# EAGLE schematic GenericCommand (EAGLE 9.1.3)
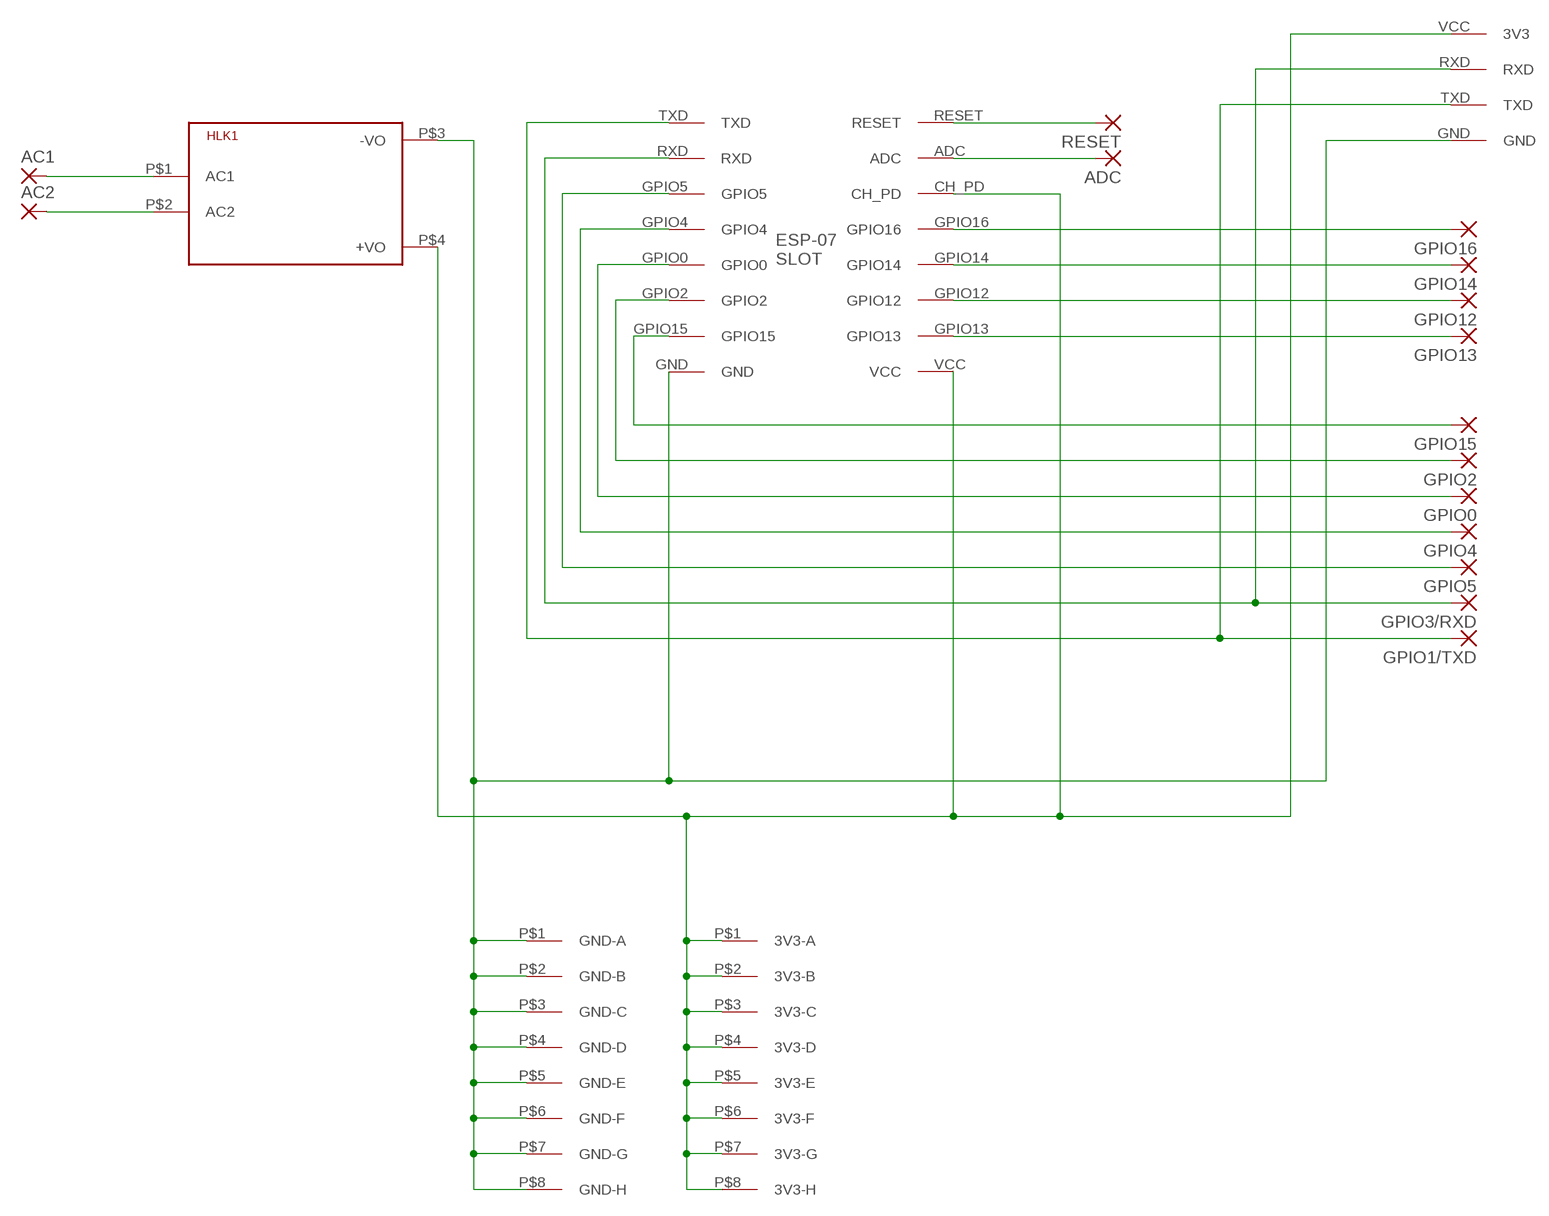
[diagram p0: schematic, sheet 1]

## Parts
AC1  3,81/1,4  [3,81/1,4]
AC2  3,81/1,4  [3,81/1,4]
ADC  1,6/0,9  [1,6/0,9]
GPIO0  1,6/0,9  [1,6/0,9]
GPIO1/TXD  1,6/0,9  [1,6/0,9]
GPIO2  1,6/0,9  [1,6/0,9]
GPIO3/RXD  1,6/0,9  [1,6/0,9]
GPIO4  1,6/0,9  [1,6/0,9]
GPIO5  1,6/0,9  [1,6/0,9]
GPIO12  1,6/0,9  [1,6/0,9]
GPIO13  1,6/0,9  [1,6/0,9]
GPIO14  1,6/0,9  [1,6/0,9]
GPIO15  1,6/0,9  [1,6/0,9]
GPIO16  1,6/0,9  [1,6/0,9]
HLK1  HLK-PM013W  [HLK-PM01]
RESET  1,6/0,9  [1,6/0,9]
U$1  ESP-07  [ESP-07]
U$2  CP-2102-CONN  [CP-2102-CONN]
U$3  3V3-8  [3.3V-8]
U$4  GND-8  [GND-8]

## Nets
N$1: GPIO15.1(P) U$1.GPIO15
N$2 [3.3VPower]: HLK1.P$3(-VO) U$1.GND U$2.GND U$4.P$1(GND-A) U$4.P$2(GND-B) U$4.P$3(GND-C) U$4.P$4(GND-D) U$4.P$5(GND-E) U$4.P$6(GND-F) U$4.P$7(GND-G) U$4.P$8(GND-H)
N$3: GPIO2.1(P) U$1.GPIO2
N$4: GPIO0.1(P) U$1.GPIO0
N$5: GPIO16.1(P) U$1.GPIO16
N$6: GPIO14.1(P) U$1.GPIO14
N$7: GPIO12.1(P) U$1.GPIO12
N$8: GPIO13.1(P) U$1.GPIO13
N$9: GPIO4.1(P) U$1.GPIO4
N$10 [3.3VPower]: HLK1.P$4(+VO) U$1.CH_PD U$1.VCC U$2.VCC(3V3) U$3.P$1(3V3-A) U$3.P$2(3V3-B) U$3.P$3(3V3-C) U$3.P$4(3V3-D) U$3.P$5(3V3-E) U$3.P$6(3V3-F) U$3.P$7(3V3-G) U$3.P$8(3V3-H)
N$11: GPIO5.1(P) U$1.GPIO5
N$12: GPIO3/RXD.1(P) U$1.RXD U$2.RXD
N$13: GPIO1/TXD.1(P) U$1.TXD U$2.TXD
N$14: ADC.1(P) U$1.ADC
N$15: RESET.1(P) U$1.RESET
N$16 [Main]: AC2.1(P) HLK1.P$2(AC2)
N$17 [Main]: AC1.1(P) HLK1.P$1(AC1)

## Library data of the parts
AC1 AC2 = wirepad:3,81/1,4: THROUGH-HOLE PAD
ADC GPIO0 GPIO1/TXD GPIO2 GPIO3/RXD GPIO4 GPIO5 GPIO12-GPIO16 RESET = wirepad:1,6/0,9: THROUGH-HOLE PAD
HLK1 = HLK-PM01:HLK-PM01: Hi-Link Power Supply HLK-PM01 3W Author: Ahmed Said <https://github.com/AhmedSaid/EAGLELibraries>
U$1 = home-mind:ESP-07
U$2 = home-mind:CP-2102-CONN
U$3 = home-mind:3V3-8
U$4 = home-mind:GND-8

## Net classes
0 default: width 0.3 mm, drill 0.3 mm, clearance 0.5 mm
1 Main: width 2 mm, drill 1 mm, clearance 2 mm
2 3.3VPower: width 1 mm, drill 0.5 mm, clearance 0.5 mm